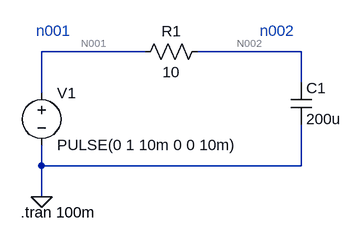
[diagram p0: schematic Yoneda-p52__Pulse+R+C=200u.asc]
Yoneda-p52__Pulse+R+C=200u.asc, the LTspice schematic file:
Version 4
SHEET 1 888 680
WIRE 576 -448 416 -448
WIRE 816 -448 656 -448
WIRE 816 -400 816 -448
WIRE 416 -384 416 -448
WIRE 416 -272 416 -304
WIRE 816 -272 816 -336
WIRE 816 -272 416 -272
WIRE 416 -224 416 -272
FLAG 416 -224 0
SYMBOL voltage 416 -400 R0
WINDOW 123 0 0 Left 2
WINDOW 39 0 0 Left 2
SYMATTR InstName V1
SYMATTR Value PULSE(0 1 10m 0 0 10m)
SYMBOL res 560 -432 R270
WINDOW 0 32 56 VTop 2
WINDOW 3 0 56 VBottom 2
SYMATTR InstName R1
SYMATTR Value 10
SYMBOL cap 800 -400 R0
SYMATTR InstName C1
SYMATTR Value 200u
TEXT 384 -200 Left 2 !.tran 100m
TEXT 408 -480 Left 2 ;n001
TEXT 752 -480 Left 2 ;n002

The netlist it stands for:
* Yoneda-p52__Pulse+R+C=200u.asc
V1 N001 0 PULSE(0 1 10m 0 0 10m)
R1 N001 N002 10
C1 N002 0 200u
.tran 100m
* n001
* n002
.backanno
.end

* Results of the author's LTspice run, read from the files saved beside the schematic
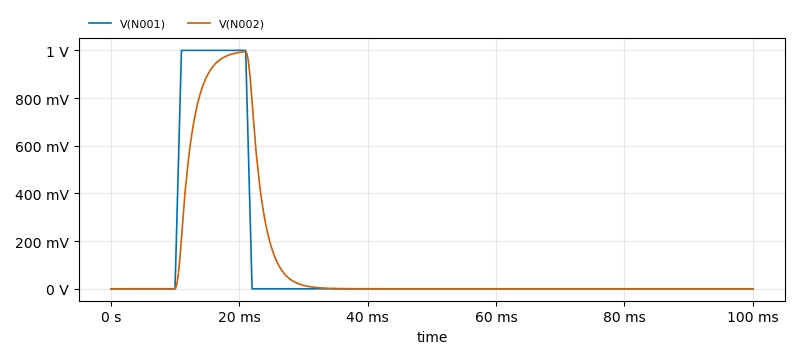
[diagram p1: Transient Analysis of Yoneda-p52__Pulse+R+C=200u.asc, plotted from the saved traces]
* Transient Analysis, 1 run:
*   V(N001): min 0 V, max 1 V, average 110 mV, rms 326.7 mV, last 0 V
*   V(N002): min 0 V, max 994.7 mV, average 110 mV, rms 299.7 mV, last 0 V